# EAGLE design SparkFun_GPS_ZED-F9R_BoB (EAGLE 9.5.2)

## Sheet 1 of 3
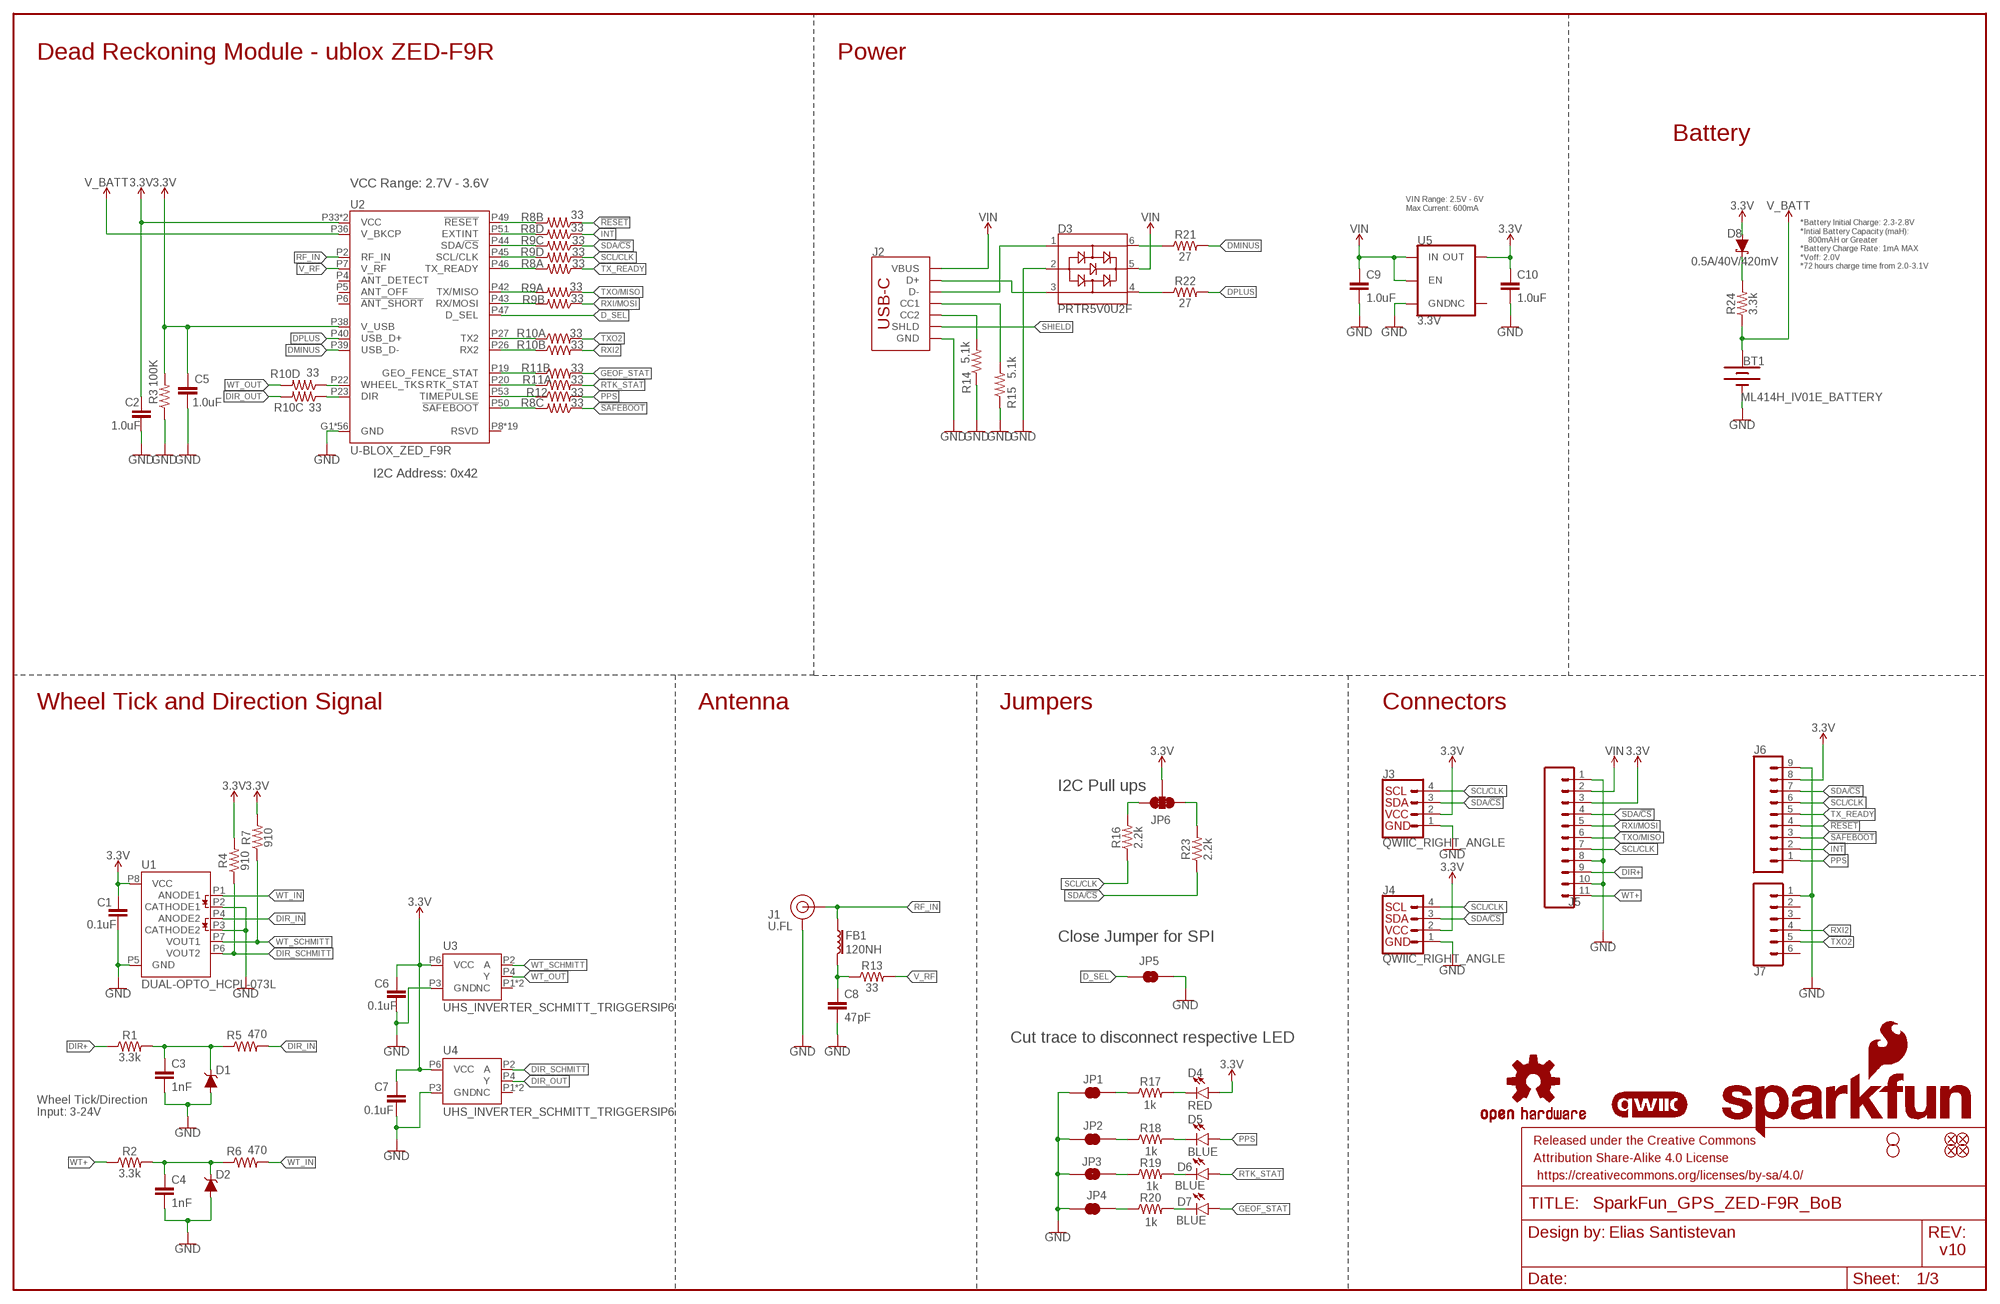
[diagram p0: schematic, sheet 1]

### Parts
$1_25_$_2020-03-30_22-52-05  STAND-OFFTIGHT  [STAND-OFF-TIGHT]
BT1  ML414H_IV01E_BATTERY  [ML414H_IV01E]
C1  0.1uF  0.1UF-0402-10V-10%-X7R  [0402]
C2  1.0uF  1.0UF-0603-16V-10%-X7R  [0603]
C3  1nF  1.0NF/1000PF-0402-25V-10%-X7R  [0402]
C4  1nF  1.0NF/1000PF-0402-25V-10%-X7R  [0402]
C5  1.0uF  1.0UF-0603-16V-10%-X7R  [0603]
C6  0.1uF  0.1UF-0402-10V-10%-X7R  [0402]
C7  0.1uF  0.1UF-0402-10V-10%-X7R  [0402]
C8  47pF  47PF-0402-25V-5%-X7R  [0402]
C9  1.0uF  1.0UF-0603-16V-10%-X7R  [0603]
C10  1.0uF  1.0UF-0603-16V-10%-X7R  [0603]
D1  15V  DIODE-ZENER-BZX84C15LT3G  [SOT23-3]
D2  15V  DIODE-ZENER-BZX84C15LT3G  [SOT23-3]
D3  PRTR5V0U2F  [SOT886]
D4  RED  LED-RED0603  [LED-0603]
D5  BLUE  LED-BLUE0603  [LED-0603]
D6  BLUE  LED-BLUE0603  [LED-0603]
D7  BLUE  LED-BLUE0603  [LED-0603]
D8  0.5A/40V/420mV  DIODE-SCHOTTKY-PMEG4005EJ  [SOD-323]
FB1  120NH  FERRITE_BEAD_GNSS  [0402_MURATA]
FD1  FIDUCIALUFIDUCIAL  [FIDUCIAL-MICRO]
FD2  FIDUCIALUFIDUCIAL  [FIDUCIAL-MICRO]
FD3  FIDUCIALUFIDUCIAL  [FIDUCIAL-MICRO]
FD4  FIDUCIALUFIDUCIAL  [FIDUCIAL-MICRO]
FRAME1  FRAME-LEDGER  [CREATIVE_COMMONS]
H2  STAND-OFFTIGHT  [STAND-OFF-TIGHT]
J1  U.FL  U.FL2PIN  [U.FL]
J2  USB_C_2-LAYER_PADS  [USB-C-16P-2LAYER-PADS]
J3  QWIIC_RIGHT_ANGLE  QWIIC_CONNECTORJS-1MM  [JST04_1MM_RA]
J4  QWIIC_RIGHT_ANGLE  QWIIC_CONNECTORJS-1MM  [JST04_1MM_RA]
J5  CONN_111X11_NO_SILK  [1X11_NO_SILK]
J6  CONN_09NO_SILK  [1X09_NO_SILK]
J7  CONN_06NO_SILK_NO_POP  [1X06_NO_SILK]
JP1  JUMPER-SMT_2_NC_TRACE_SILK  [SMT-JUMPER_2_NC_TRACE_SILK]
JP2  JUMPER-SMT_2_NC_TRACE_SILK  [SMT-JUMPER_2_NC_TRACE_SILK]
JP3  JUMPER-SMT_2_NC_TRACE_SILK  [SMT-JUMPER_2_NC_TRACE_SILK]
JP4  JUMPER-SMT_2_NC_TRACE_SILK  [SMT-JUMPER_2_NC_TRACE_SILK]
JP5  JUMPER-SMT_2_NO_SILK  [SMT-JUMPER_2_NO_SILK]
JP6  JUMPER-SMT_3_2-NC_TRACE_SILK  [SMT-JUMPER_3_2-NC_TRACE_SILK]
LOGO1  OSHW-LOGOM  [OSHW-LOGO-M]
LOGO2  QWIIC_LOGO_4MM  [QWIIC_4MM]
LOGO3  SFE_LOGO_NAME_FLAME.2_INCH  [SFE_LOGO_NAME_FLAME_.2]
R1  3.3k  3.3KOHM-0603-1/10W-1%  [0603]
R2  3.3k  3.3KOHM-0603-1/10W-1%  [0603]
R3  100K  100KOHM-0402-1/16W-1%  [0402]
R4  910  910OHM-0603-1/10W-5%  [0603]
R5  470  470OHM-0603-1/10W-1%  [0603]
R6  470  470OHM-0603-1/10W-1%  [0603]
R7  910  910OHM-0603-1/10W-5%  [0603]
R8  33  33OHM_RA-1206-1/16W-5%  [1206_RA]
R9  33  33OHM_RA-1206-1/16W-5%  [1206_RA]
R10  33  33OHM_RA-1206-1/16W-5%  [1206_RA]
R11  33  33OHM_RA-1206-1/16W-5%  [1206_RA]
R12  33  33OHM-0603-1/10W-1%  [0603]
R13  33  33OHM-0603-1/10W-1%  [0603]
R14  5.1k  5.1KOHM-0402-1/16W-1%  [0402]
R15  5.1k  5.1KOHM-0402-1/16W-1%  [0402]
R16  2.2k  2.2KOHM-0603-1/10W-1%  [0603]
R17  1KOHM-0402-1/16W-1%  [0402]
R18  1KOHM-0402-1/16W-1%  [0402]
R19  1KOHM-0402-1/16W-1%  [0402]
R20  1KOHM-0402-1/16W-1%  [0402]
R21  27  27OHM-0603-1/10W-1%  [0603]
R22  27  27OHM-0603-1/10W-1%  [0603]
R23  2.2k  2.2KOHM-0603-1/10W-1%  [0603]
R24  3.3k  3.3KOHM-0603-1/10W-1%  [0603]
U1  DUAL-OPTO_HCPL-073L  [SOP_8-PIN]
U2  U-BLOX_ZED_F9R  [UBLOX_ZED_F9R]
U3  UHS_INVERTER_SCHMITT_TRIGGERSIP6  [SIP6]
U4  UHS_INVERTER_SCHMITT_TRIGGERSIP6  [SIP6]
U5  3.3V  V_REG_AP2112K-3.3V  [SOT23-5]

### Nets
3.3V: C1.1 C2.1 C5.1 C6.1 C7.1 C10.1 D4.A D8.A J3.2 J4.2 J5.3 J6.8 JP6.2 R3.2 R4.2 R7.2 U1.P8(VCC) U2.P33(VCC) U2.P34(VCC) U2.P38(V_USB) U3.P6(VCC) U4.P6(VCC) U5.5(OUT)
!RESET: J6.4 R8.P2
!SAFEBOOT: J6.3 R8.P3
D_SEL: JP5.1 U2.P47(D_SEL)
DIR+: J5.9 R1.1
DIR_IN: R5.2 U1.P4(ANODE2)
DIR_OUT: R10.P6 U4.P4(Y)
DIR_SCHMITT: R4.1 U1.P6(VOUT2) U4.P2(A)
DMINUS: R21.2 U2.P39(USB_D-)
DPLUS: R22.2 U2.P40(USB_D+)
GEOF_STAT: D7.A R11.P7
GND: BT1.- C1.2 C2.2 C3.2 C4.2 C5.2 C6.2 C7.2 C8.2 C9.2 C10.2 D1.1(A) D2.1(A) D3.2 J1.1(GND) J1.2(GND) J2.GND J2.GND2(GND) J3.1 J4.1 J5.1 J5.8 J5.10 J6.9 J7.1 JP1.1 JP2.1 JP3.1 JP4.1 JP5.2 R3.1 R14.1 R15.1 U1.P2(CATHODE1) U1.P3(CATHODE2) U1.P5(GND) U2.G1(GND) U2.G2(GND) U2.G3(GND) U2.G4(GND) U2.G5(GND) U2.G6(GND) U2.G7(GND) U2.G8(GND) U2.G9(GND) U2.G10(GND) U2.G11(GND) U2.G12(GND) U2.G13(GND) U2.G14(GND) U2.G15(GND) U2.G16(GND) U2.G17(GND) U2.G18(GND) U2.G19(GND) U2.G20(GND) U2.G21(GND) U2.G22(GND) U2.G23(GND) U2.G24(GND) U2.G25(GND) U2.G26(GND) U2.G27(GND) U2.G28(GND) U2.G29(GND) U2.G30(GND) U2.G31(GND) U2.G32(GND) U2.G33(GND) U2.G34(GND) U2.G35(GND) U2.G36(GND) U2.G37(GND) U2.G38(GND) U2.G39(GND) U2.G40(GND) U2.G41(GND) U2.G42(GND) U2.G43(GND) U2.G44(GND) U2.G45(GND) U2.G46(GND) U2.G47(GND) U2.G48(GND) U2.P1(GND) U2.P3(GND) U2.P12(GND) U2.P14(GND) U2.P32(GND) U2.P37(GND) U2.P41(GND) U2.P48(GND) U3.P3(GND) U4.P3(GND) U5.2(GND)
INT: J6.2 R8.P4
N$1: JP6.1 R23.2
N$2: D8.C R24.2
N$3: JP6.3 R16.2
N$4: D4.C R17.2
N$5: C8.1 FB1.P2 R13.1
N$6: D3.3 J2.A6(D+) J2.B6(D+)
N$7: D3.1 J2.A7(D-) J2.B7(D-)
N$8: JP1.2 R17.1
N$9: D3.6 R21.1
N$10: D3.4 R22.1
N$11: R8.P7 U2.P49(!RESET!)
N$12: R8.P5 U2.P51(EXTINT)
N$14: J2.B5(CC2) R14.2
N$15: J2.A5(CC1) R15.2
N$16: R9.P6 U2.P44(SDA/!CS!)
N$17: R9.P5 U2.P45(SCL/CLK)
N$18: R8.P8 U2.P46(TX_READY)
N$19: R9.P8 U2.P42(TX/MISO)
N$20: R9.P7 U2.P43(RX/MOSI)
N$21: R10.P1 U2.P27(TX2)
N$22: JP3.2 R19.1
N$23: JP2.2 R18.1
N$24: D5.C R18.2
N$25: D6.C R19.2
N$26: R10.P2 U2.P26(RX2)
N$27: R11.P2 U2.P19(GEO_FENCE_STAT)
N$28: R11.P1 U2.P20(RTK_STAT)
N$29: R12.1 U2.P53(TIMEPULSE)
N$30: R8.P6 U2.P50(!SAFEBOOT!)
N$31: R10.P4 U2.P22(WHEEL_TKS)
N$32: R10.P3 U2.P23(DIR)
N$33: JP4.2 R20.1
N$34: D7.C R20.2
N$35: C4.1 D2.3(C) R2.2 R6.1
N$37: C3.1 D1.3(C) R1.2 R5.1
PPS: D5.A J6.1 R12.2
RF_IN [Antenna]: FB1.P1 J1.FEED(SIGNAL) U2.P2(RF_IN)
RTK_STAT: D6.A R11.P8
RXI2: J7.4 R10.P7
RXI/MOSI: J5.5 R9.P2
SCL/CLK: J3.4 J4.4 J5.7 J6.6 R9.P4 R16.1
SDA/!CS: J3.3 J4.3 J5.4 J6.7 R9.P3 R23.1
SHIELD: J2.SHLD1(SHLD) J2.SHLD2(SHLD) J2.SHLD3(SHLD) J2.SHLD4(SHLD)
TX_READY: J6.5 R8.P1
TXO2: J7.5 R10.P8
TXO/MISO: J5.6 R9.P1
V_BATT: BT1.+ R24.1 U2.P36(V_BKCP)
V_RF: R13.2 U2.P7(V_RF)
VIN: C9.1 D3.5 J2.VBUS1(VBUS) J2.VBUS2(VBUS) J5.2 U5.1(IN) U5.3(EN)
WT+: J5.11 R2.1
WT_IN: R6.2 U1.P1(ANODE1)
WT_OUT: R10.P5 U3.P4(Y)
WT_SCHMITT: R7.1 U1.P7(VOUT1) U3.P2(A)
Unconnected: J7.2 J7.3 J7.6 R11.P3 R11.P4 R11.P5 R11.P6 U2.P4(ANT_DETECT) U2.P5(ANT_OFF) U2.P6(!ANT_SHORT!) U2.P8(RSVD) U2.P9(RSVD) U2.P10(RSVD) U2.P11(RSVD) U2.P13(RSVD) U2.P15(RSVD) U2.P16(RSVD) U2.P17(RSVD) U2.P18(RSVD) U2.P21(RSVD) U2.P24(RSVD) U2.P25(RSVD) U2.P28(RSVD) U2.P29(RSVD) U2.P30(RSVD) U2.P31(RSVD) U2.P35(RSVD) U2.P52(RSVD) U2.P54(RSVD) U3.P1(NC) U3.P5(NC) U4.P1(NC) U4.P5(NC) U5.4(NC)

### Notes on the sheet
- Dead Reckoning Module - ublox ZED-F9R | Power
- Battery
- VCC Range: 2.7V - 3.6V
- VIN Range: 2.5V - 6V
  Max Current: 600mA
- *Battery Initial Charge: 2.3-2.8V
  *Intial Battery Capacity (maH): 
      800mAH or Greater
  *Battery Charge Rate: 1mA MAX
  *Voff: 2.0V
  *72 hours charge time from 2.0-3.1V
- I2C Address: 0x42
- Wheel Tick and Direction Signal | Antenna | Jumpers | Connectors
- I2C Pull ups
- Close Jumper for SPI
- Cut trace to disconnect respective LED
- 1k
- Wheel Tick/Direction
  Input: 3-24V
- 1k
- 1k
- 1k
- Elias Santistevan
- v10

## Sheet 2 of 3

## Sheet 3 of 3

## Library data of the parts
$1_25_$_2020-03-30_22-52-05 H2 = SparkFun-Hardware:STAND-OFF: Stand Off Drill holes for mechanically mounting via screws, standoffs, etc. Note: Use the keepout ring to avoid running the screw head into surrounding components. Variant Overviews STAND-OFF - Mechanical footprint for a #4 phillips button head screw. STAND-OFF-TIGHT - Mechanical footprint for a #4 phillips button head screw, Example SparkFun Products Screw - Phillips Head (1/4", 4-40, 10 pack) <https://www.sparkfun.com/products/10453> (PRT-10453) Screw - Phillips Head (1/2", 4-40, 10 pack) <https://www.sparkfun.com/products/10452> (PRT-10452) Screw - Phillips Head (3/4", 4-40, 10 pack) <https://www.sparkfun.com/products/10451> (PRT-10451) Screw - Phillips Head (1", 4-40, 10 pack) <https://www.sparkfun.com/products/10450> (PRT-10450)
BT1 = SparkFun-Batteries:ML414H_IV01E_BATTERY: SEIKO ML414H-IV01E Reflowable Lithium Battery ML414H is a rechargeable, coin type battery with features such as Pb-free reflowable (Peak temperature: 260 C) and high temperature heat resistance. Battery Characteristics: 3.1V max voltage Voff is 2V 1mAH 3k series resistor with battery 72 hour charge time from 2.0-3.1V 2.3-2.8V initial charge; PROD_ID: BATT-14267
C1 C6 C7 = SparkFun-Capacitors:0.1UF: 0.1µF ceramic capacitors A capacitor is a passive two-terminal electrical component used to store electrical energy temporarily in an electric field.; PROD_ID: CAP-15083
C2 C5 C9 C10 = SparkFun-Capacitors:1.0UF: 1µF ceramic capacitors A capacitor is a passive two-terminal electrical component used to store electrical energy temporarily in an electric field.; PROD_ID: CAP-13930
C3 C4 = SparkFun-Capacitors:1.0NF/1000PF: 1nF/1,000pF ceramic capacitors A capacitor is a passive two-terminal electrical component used to store electrical energy temporarily in an electric field.; PROD_ID: CAP-15061
C8 = SparkFun-Capacitors:47PF: 47pF ceramic capacitors A capacitor is a passive two-terminal electrical component used to store electrical energy temporarily in an electric field.; PROD_ID: CAP-15063
D1 D2 = SparkFun-DiscreteSemi:DIODE-ZENER: Zener Diode A Zener diode allows current to flow from its anode to its cathode like a normal semiconductor diode, but it also permits current to flow in the reverse direction when its "Zener voltage" is reached. - WIkipedia; PROD_ID: DIO-15071
D3 = SparkFun-IC-Power:PRTR5V0U2: A small ESD protection device. Most commonly used on USB D+/D- signals to protect large, expensive, or especially sensitive USB enabled devices.; PROD_ID: DIO-14084
D4 = SparkFun-LED:LED-RED: Red SMD LED Used in manufacturing of most products at SparkFun Packages: 0603 - SMD 0603 package [Product Link] <http://docs.avagotech.com/docs/AV02-0551EN> 0603 SMART - SMD 0603 SMART package ( more efficient and expensive)[Product Link] <http://www.osram-os.com/Graphics/XPic2/00077099_0.pdf> 1206 - SMD1206 package [Product Link] <https://www.sparkfun.com/datasheets/DevTools/LilyPad/Q150OVS4.pdff> SparkFun Products: Pro Mini 328 -5V <https://www.sparkfun.com/products/821> RedBoard <https://www.sparkfun.com/products/12757> IOIO-OTG <https://www.sparkfun.com/products/13613>; PROD_ID: DIO-00819
D5-D7 = SparkFun-LED:LED-BLUE: Blue SMD LED Used in manufacturing of various products at SparkFun Packages: 0603 - SMD 0603 package [Product Link] <http://www.digikey.com/product-detail/en/SMLE12BC7TT86/511-1589-2-ND/1641808> 1206 - SMD1206 package [Product Link] <http://www.digikey.com/product-detail/en/lite-on-inc/LTST-C150TBKT/160-1643-1-ND/573584> SparkFun Products: ESP8266 Thing-Dev Board <https://www.sparkfun.com/products/13711> RedBoard <https://www.sparkfun.com/products/12757>; PROD_ID: DIO-08575
D8 = SparkFun-DiscreteSemi:DIODE-SCHOTTKY: Schottky diode A Schottky diode is a semiconductor diode which has a low forward voltage drop and a very fast switching action.; PROD_ID: DIO-10955
FB1 = SparkFun-Coils:FERRITE_BEAD_GNSS; PROD_ID: NDUC-15072
FD1-FD4 = SparkFun-Aesthetics:FIDUCIAL: Fiducial Alignment Points Point-of-reference for pick-and-place machines and other optical instruments.
FRAME1 = SparkFun-Aesthetics:FRAME-LEDGER: Schematic Frame - Ledger Standard 11x14 US Ledger frame
J1 = SparkFun-Connectors:U.FL2PIN: SMD Antenna Connector - U.FL 2mm height, 3.0mm x 3.0mm receptacle size. SparkFun Products: SparkFun WiFi Shield - ESP8266 <https://www.sparkfun.com/products/13287> SparkFun ESP8266 Thing <https://www.sparkfun.com/products/13231> SparkFun MiniGen - Pro Mini Signal Generator Shield <https://www.sparkfun.com/products/11420>; PROD_ID: CONN-09193; SF_ID: WRL-09144
J2 = SparkFun-Connectors:USB_C: USB Type C 16Pin Connector Super Speed pins not available on the 16-pin purely SMD connector so this part is best for USB 2.0 implementations. D1 and D2 are tied together enabling D+/- no matter which way the cable is plugged into the connector. The two channel configuration pins (CC1/2) are exposed. These are normally connected to ground via 5.1k resistors but can be reconfigured for high current/high power applications.; PROD_ID: CONN-14122
J3 J4 = SparkFun-Connectors:QWIIC_CONNECTOR: SparkFun I2C Standard Qwiic Connector An SMD 1mm pitch JST connector makes it easy and quick (get it? Qwiic?) to connect I2C devices to each other. The Qwiic system <http://www.sparkfun.com/qwiic> enables fast and solderless connection between popular platforms and various sensors and actuators. We carry 200mm <https://www.sparkfun.com/products/14204>, 100mm <https://www.sparkfun.com/products/14205>, 50mm <https://www.sparkfun.com/products/14206>, and breadboard friendly <https://www.sparkfun.com/products/14207> Qwiic cables. We also offer 10 pcs strips <https://www.sparkfun.com/products/14323> the SMD connectors.; PROD_ID: CONN-13694
J5 = SparkFun-Connectors:CONN_11: Multi connection point. Often used as Generic Header-pin footprint for 0.1 inch spaced/style header connections On any of the 0.1 inch spaced packages, you can populate with these: Break Away Headers - Straight <https://www.sparkfun.com/products/116> (PRT-00116) Break Away Male Headers - Right Angle <https://www.sparkfun.com/products/553> (PRT-00553) Female Headers <https://www.sparkfun.com/products/115> (PRT-00115) Break Away Headers - Machine Pin <https://www.sparkfun.com/products/117> (PRT-00117) Break Away Female Headers - Swiss Machine Pin <https://www.sparkfun.com/products/743> (PRT-00743) For SCREWTERMINALS and SPRING TERMINALS visit here: Screw Terimnals on SparkFun.com <https://www.sparkfun.com/search/results?term=Screw+Terminals> (5mm/3.5mm/2.54mm spacing) This device is also useful as a general connection point to wire up your design to another part of your project. Our various solder wires solder well into these plated through hole pads. Hook-Up Wire - Assortment (Stranded, 22 AWG) <https://www.sparkfun.com/products/11375> (PRT-11375) Hook-Up Wire - Assortment (Solid Core, 22 AWG) <https://www.sparkfun.com/products/11367> (PRT-11367) View the entire wire category on our website here <https://www.sparkfun.com/categories/141>
J6 = SparkFun-Connectors:CONN_09: Multi connection point. Often used as Generic Header-pin footprint for 0.1 inch spaced/style header connections On any of the 0.1 inch spaced packages, you can populate with these: Break Away Headers - Straight <https://www.sparkfun.com/products/116> (PRT-00116) Break Away Male Headers - Right Angle <https://www.sparkfun.com/products/553> (PRT-00553) Female Headers <https://www.sparkfun.com/products/115> (PRT-00115) Break Away Headers - Machine Pin <https://www.sparkfun.com/products/117> (PRT-00117) Break Away Female Headers - Swiss Machine Pin <https://www.sparkfun.com/products/743> (PRT-00743) For SCREWTERMINALS and SPRING TERMINALS visit here: Screw Terimnals on SparkFun.com <https://www.sparkfun.com/search/results?term=Screw+Terminals> (5mm/3.5mm/2.54mm spacing) This device is also useful as a general connection point to wire up your design to another part of your project. Our various solder wires solder well into these plated through hole pads. Hook-Up Wire - Assortment (Stranded, 22 AWG) <https://www.sparkfun.com/products/11375> (PRT-11375) Hook-Up Wire - Assortment (Solid Core, 22 AWG) <https://www.sparkfun.com/products/11367> (PRT-11367) View the entire wire category on our website here <https://www.sparkfun.com/categories/141> Special notes: Molex polarized connector foot print use with SKU : PRT-08231 with associated crimp pins and housings. 1MM SMD Version SKU: PRT-10208 NOTES ON THE VARIANTS LOCK and LOCK_LONGPADS... This footprint was designed to help hold the alignment of a through-hole component (i.e. 6-pin header) while soldering it into place. You may notice that each hole has been shifted either up or down by 0.005 of an inch from it's more standard position (which is a perfectly straight line). This slight alteration caused the pins (the squares in the middle) to touch the edges of the holes. Because they are alternating, it causes a "brace" to hold the component in place. 0.005 has proven to be the perfect amount of "off-center" position when using our standard breakaway headers. Although looks a little odd when you look at the bare footprint, once you have a header in there, the alteration is very hard to notice. Also,if you push a header all the way into place, it is covered up entirely on the bottom side.
J7 = SparkFun-Connectors:CONN_06: Multi connection point. Often used as Generic Header-pin footprint for 0.1 inch spaced/style header connections On any of the 0.1 inch spaced packages, you can populate with these: Break Away Headers - Straight <https://www.sparkfun.com/products/116> (PRT-00116) Break Away Male Headers - Right Angle <https://www.sparkfun.com/products/553> (PRT-00553) Female Headers <https://www.sparkfun.com/products/115> (PRT-00115) Break Away Headers - Machine Pin <https://www.sparkfun.com/products/117> (PRT-00117) Break Away Female Headers - Swiss Machine Pin <https://www.sparkfun.com/products/743> (PRT-00743) Arduino Stackable Header - 6 Pin <https://www.sparkfun.com/products/9280> (PRT-09280) For SCREWTERMINALS and SPRING TERMINALS visit here: Screw Terimnals on SparkFun.com <https://www.sparkfun.com/search/results?term=Screw+Terminals> (5mm/3.5mm/2.54mm spacing) This device is also useful as a general connection point to wire up your design to another part of your project. Our various solder wires solder well into these plated through hole pads. Hook-Up Wire - Assortment (Stranded, 22 AWG) <https://www.sparkfun.com/products/11375> (PRT-11375) Hook-Up Wire - Assortment (Solid Core, 22 AWG) <https://www.sparkfun.com/products/11367> (PRT-11367) View the entire wire category on our website here <https://www.sparkfun.com/categories/141>
JP1-JP4 = SparkFun-Jumpers:JUMPER-SMT_2_NC_TRACE: Normally closed trace jumper This jumper has a trace between two pads so it's normally closed (NC). Use a razor knife to open the connection. For best results follow the IPC guidelines for cutting traces: Cutout at least 0.063 mm (0.005 in). Remove all loose material to clean up the cut area. Seal the cut with an approved epoxy. Reapply solder to reclose the connection.
JP5 = SparkFun-Jumpers:JUMPER-SMT_2_NO: Normally open jumper This jumper has two pads in close proximity to each other. Apply solder to close the connection. Round pads are easier to solder for beginners, but are a lot larger. SparkFun Product that uses the round pads: SparkFun EL Sequencer <https://www.sparkfun.com/products/12781>
JP6 = SparkFun-Jumpers:JUMPER-SMT_3_2-NC_TRACE: Normally closed trace jumper (2 of 2 connections) This jumper has a trace between all three pads so they are normally closed (NC). Use a razor knife to open the connection(s). For best results follow the IPC guidelines for cutting traces: Cutout at least 0.063 mm (0.005 in). Remove all loose material to clean up the cut area. Seal the cut with an approved epoxy. Reapply solder to reclose the connection(s).
LOGO1 = SparkFun-Aesthetics:OSHW-LOGO: Open-Source Hardware (OSHW) Logo This logo indicates the piece of hardware it is found on incorporates a OSHW license and/or adheres to the definition of open source hardware found here: http://freedomdefined.org/OSHW
LOGO2 = SparkFun-Aesthetics:QWIIC_LOGO: Qwiic Logos for placement on schematic and PCB. The 5.5mm silk logo is best for placing next to Qwiic connector.
LOGO3 = SparkFun-Aesthetics:SFE_LOGO_NAME_FLAME: SparkFun Font Logo w/ Flame This is the SparkFun full logo. The logo on the schematic will always be the same size; the package variant is the height of the flame part of the logo. Default layer for the logo on the board is tSilk.
R1 R2 R24 = SparkFun-Resistors:3.3KOHM: 3.3kΩ resistor A resistor is a passive two-terminal electrical component that implements electrical resistance as a circuit element. Resistors act to reduce current flow, and, at the same time, act to lower voltage levels within circuits. - Wikipedia; PROD_ID: RES-07851
R3 = SparkFun-Resistors:100KOHM: 100kΩ resistor A resistor is a passive two-terminal electrical component that implements electrical resistance as a circuit element. Resistors act to reduce current flow, and, at the same time, act to lower voltage levels within circuits. - Wikipedia; PROD_ID: RES-13495
R4 R7 = SparkFun-Resistors:910OHM: 910 Ohm Resistor A resistor is a passive two-terminal electrical component that implements electrical resistance as a circuit element. Resistors act to reduce current flow, and, at the same time, act to lower voltage levels within circuits. - Wikipedia Digikey Link <https://www.digikey.com/product-detail/en/yageo/RC0603JR-07910RL/311-910GRTR-ND/726838>; PROD_ID: RES-13860
R5 R6 = SparkFun-Resistors:470OHM: 470Ω resistor A resistor is a passive two-terminal electrical component that implements electrical resistance as a circuit element. Resistors act to reduce current flow, and, at the same time, act to lower voltage levels within circuits. - Wikipedia; PROD_ID: RES-07869
R8-R11 = SparkFun-Resistors:33OHM_RA: EXB-38V330JV Four Resistory Array - AEC-Q200 Certified; PROD_ID: RES-15081
R12 R13 = SparkFun-Resistors:33OHM: 33Ω resistor A resistor is a passive two-terminal electrical component that implements electrical resistance as a circuit element. Resistors act to reduce current flow, and, at the same time, act to lower voltage levels within circuits. - Wikipedia; PROD_ID: RES-08270
R14 R15 = SparkFun-Resistors:5.1KOHM; PROD_ID: RES-14340
R16 R23 = SparkFun-Resistors:2.2KOHM: 2.2kΩ resistor A resistor is a passive two-terminal electrical component that implements electrical resistance as a circuit element. Resistors act to reduce current flow, and, at the same time, act to lower voltage levels within circuits. - Wikipedia; PROD_ID: RES-08272
R17-R20 = SparkFun-Resistors:1KOHM: 1kΩ resistor A resistor is a passive two-terminal electrical component that implements electrical resistance as a circuit element. Resistors act to reduce current flow, and, at the same time, act to lower voltage levels within circuits. - Wikipedia; PROD_ID: RES-14342
R21 R22 = SparkFun-Resistors:27OHM: 27Ω resistor A resistor is a passive two-terminal electrical component that implements electrical resistance as a circuit element. Resistors act to reduce current flow, and, at the same time, act to lower voltage levels within circuits. - Wikipedia; PROD_ID: RES-09334
U1 = SparkFun-DiscreteSemi:DUAL-OPTO_HCPL-073L: HCPL-073L These high gain series couplers use a Light Emitting Diode and an integrated high gain photodetector to provide extremely high current transfer ratio between input and output. Separate pins for the photodiode and output stage result in LVTTL compatible saturation voltages and high speed operation. Where desired, the VCC and VO terminals may be tied together to achieve conventional photo-darlington operation. A base access terminal allows a gain bandwidth adjustment to be made. These optocouplers are for use in LVTTL/LVCMOS or other low power applications. A 400% minimum current transfer ratio is guaranteed over 0 to +70˚C operating range for only 0.5 mA of LED current. Digikey Link <https://www.digikey.com/product-detail/en/broadcom-limited/HCPL-073L-500E/516-4204-2-ND/1234512>; PROD_ID: IC-15070
U2 = SparkFun-GPS:U-BLOX_ZED_F9R: u-blox ZED-F9K ADR GPS Unit with Real Time Kinematics (RTK) and internal IMU = Automotive Dead Reckoning; PROD_ID: IC-14716
U3 U4 = SparkFun-IC-Amplifiers:UHS_INVERTER_SCHMITT_TRIGGER: NC7SZ14 The NC7SZ14 is a single inverter with Schmitt trigger input from ON Semiconductor’s Ultra−High Speed (UHS) series of TinyLogic. The device is fabricated w ith advanced CMOS technology to achieve ultra−high speed with high output drive while maintaining low static power dissipation over a very broad VCC operating range. The device is specified to operate over the 1.65 V to 5.5 V VCC range. The inputs and outputs are high−impedance when VCC is 0 V. Inputs tolerate voltages up to 5.5 V independent of VCC operating voltage. Digikey Link <https://www.digikey.com/product-detail/en/on-semiconductor/NC7SZ14M5X/NC7SZ14M5XDKR-ND/1628606>; PROD_ID: IC-15068
U5 = SparkFun-IC-Power:V_REG_AP2112: AP2112 - 600mA CMOS LDO Regulator w/ Enable The AP2112 is CMOS process low dropout linear regulator with enable function, the regulator delivers a guaranteed 600mA (min.) continuous load current. Features Output Voltage Accuracy: ±1.5% Output Current: 600mA (Min.) Foldback Short Current Protection: 50mA Enable Function to Turn ON/OFF VOUT Low Dropout Voltage (3.3V): 250mV (Typ.) @IOUT=600mA Excellent Load Regulation: 0.2%/A (Typ.) Excellent Line Regulation: 0.02%/V (Typ.) Low Quiescent Current: 55μA (Typ.) Low Standby Current: 0.01μA (Typ.) Low Output Noise: 50μVRMS PSRR: 100Hz -65dB, 1kHz -65dB OTSD Protection Stable with 1.0μF Flexible Cap: Ceramic, Tantalum and Aluminum Electrolytic Operation Temperature Range: -40°C to 85°C ESD: MM 400V, HBM 4000V; PROD_ID: VREG-12457

## Net classes
1 Antenna: width 1 mm, clearance 0.3 mm

## Board
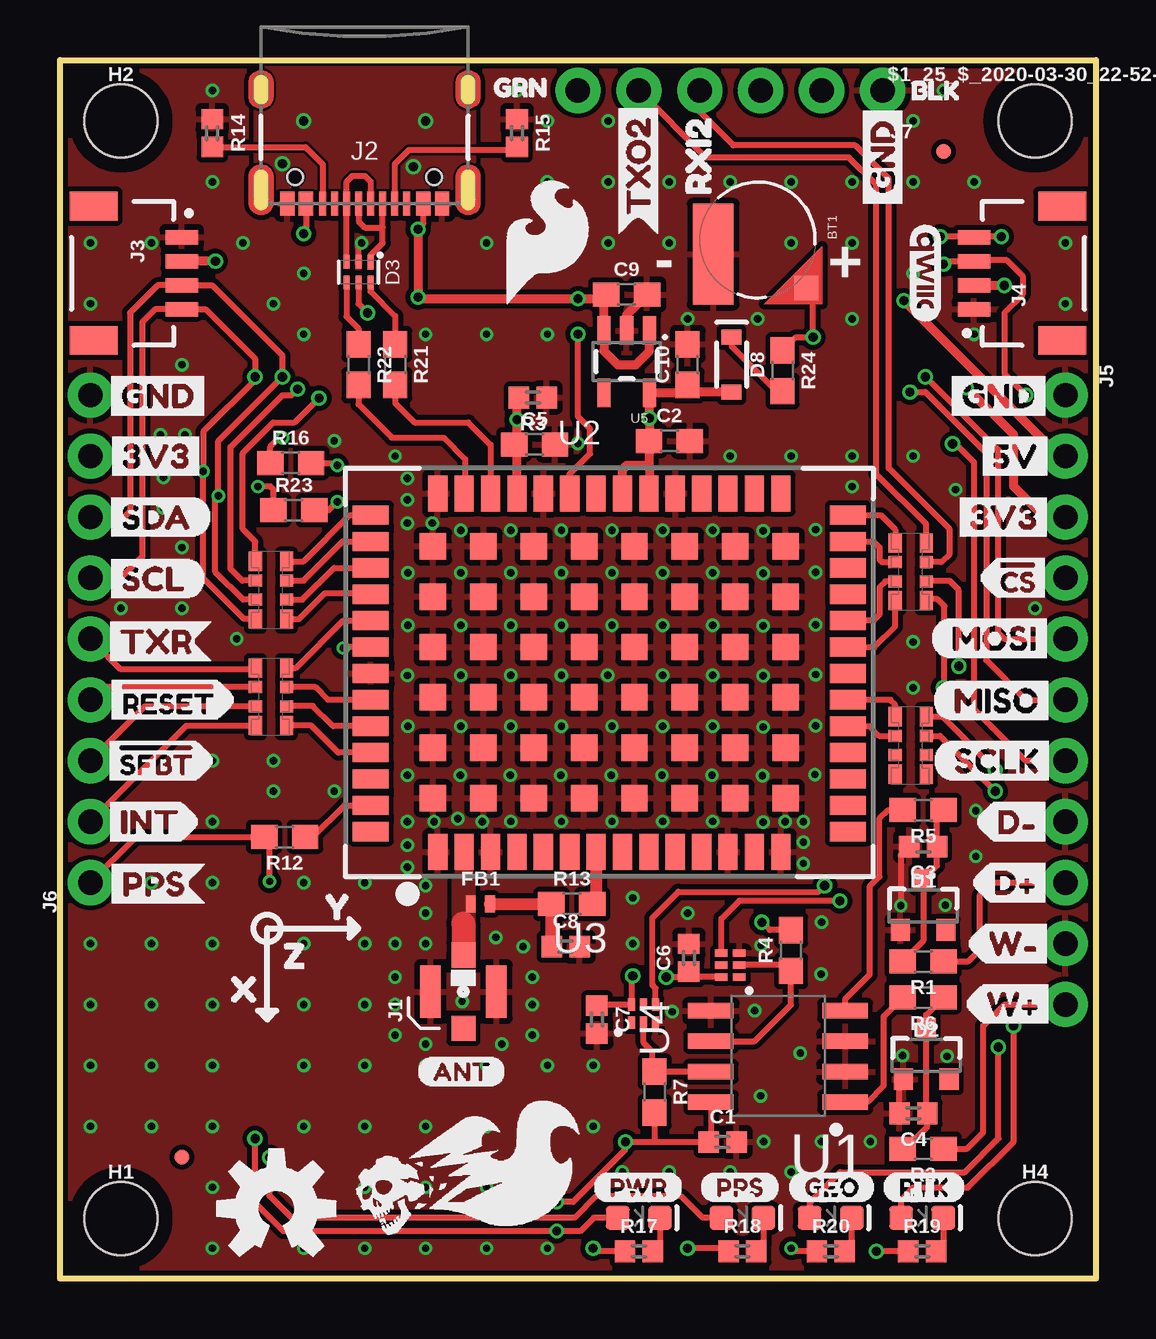
[diagram p1: board, top side]
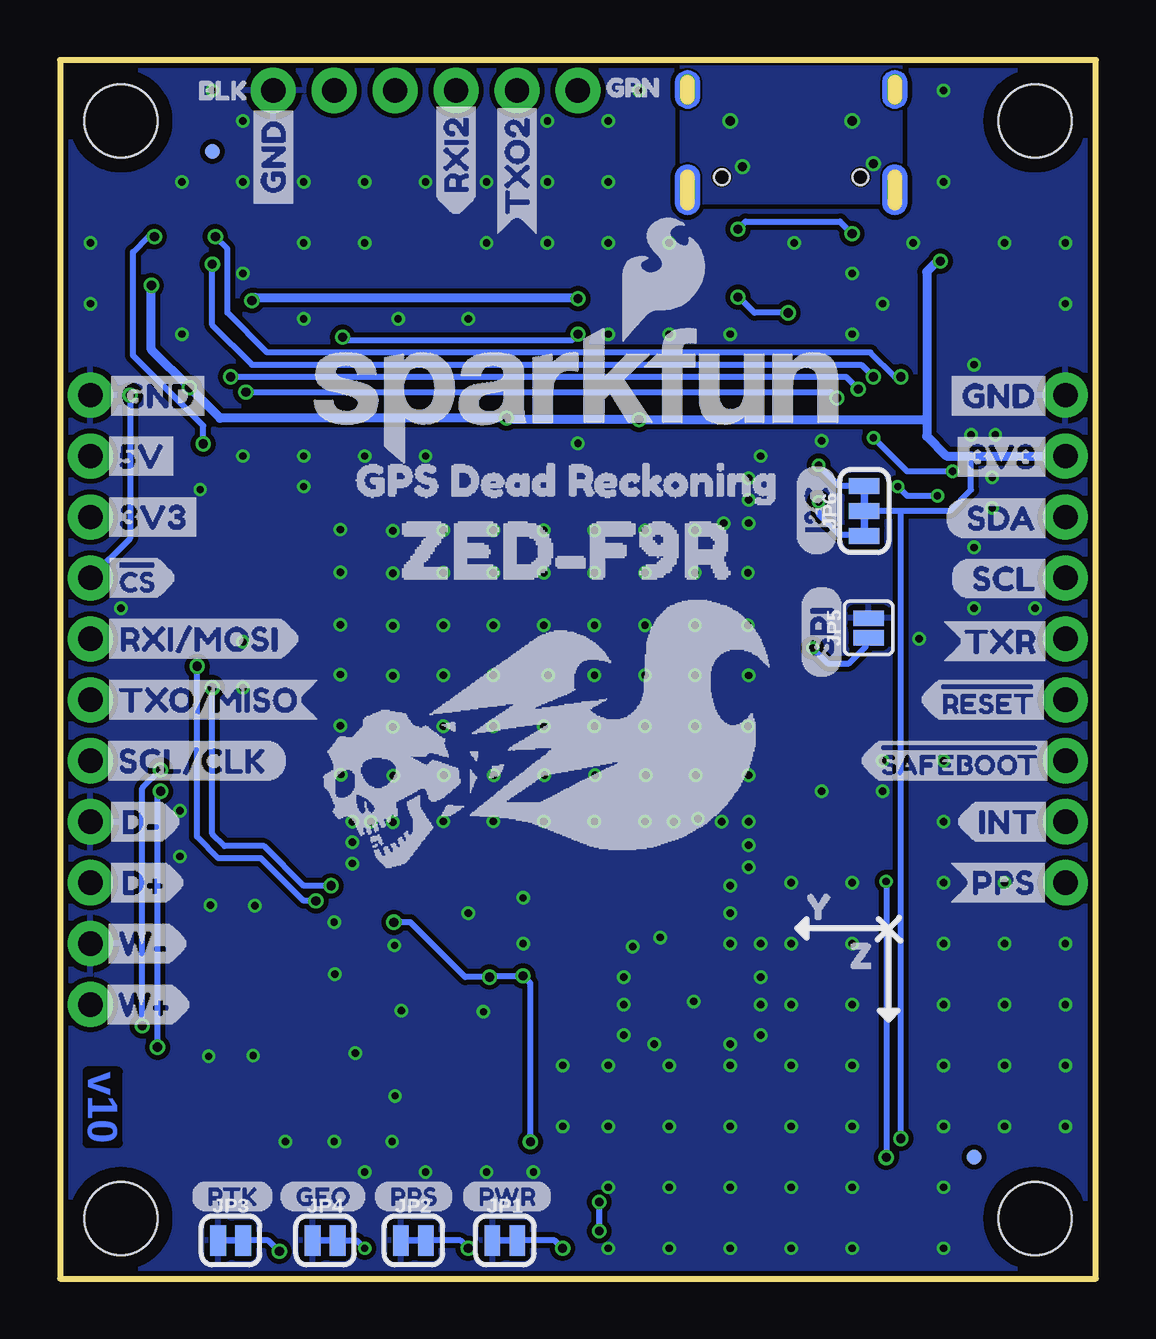
[diagram p2: board, bottom side, seen from below]

Size 43.18 x 50.8 mm. Coordinates in mm from the lower left corner, seen from the top.
Outline: 0,0 0,50.8 43.18,50.8 43.18,0 0,0
Copper layers (1*16): Top 0.035mm / dielectric 1.5mm / Bottom 0.035mm
Design rules "SparkFun-2-layer-FAB-LIMIT": minimum track width 4mil, minimum drill 6mil, track to track 4mil, track to pad 4mil, pad to pad 4mil, via to via 4mil, smd to smd 4mil, copper to edge 4mil, drill to drill 4mil, minimum pad ring 5mil, minimum via ring 5mil, stop-mask expansion 4mil, vias tented up to drill 25mil, thermal gap 10mil

### Footprints (pad centres in the part's own frame; a part is rotated, then mirrored left to right if it is on the bottom)
STAND-OFF-TIGHT = hole 3.048: 0,0
ML414H_IV01E = smd 1 x 1: + 2.022,2.032 | smd 4.2 x 1.7: - 0.6,-1.85
0402 = smd 0.85 x 0.9: 1 -0.58,0; 2 0.58,0
0603 = smd 1.1 x 1: 1 -0.85,0; 2 0.85,0
SOT23-3 = smd 0.8 x 0.9: 1 -0.95,-1; 2 0.95,-1; 3 0,1.1
SOT886 = smd 0.61 x 0.25: 1 -0.405,0.5 | smd 0.56 x 0.25: 2 -0.43,0; 3 -0.43,-0.5; 4 0.43,-0.5; 5 0.43,0; 6 0.43,0.5
LED-0603 = smd 1 x 1: A -0.877,0; C 0.877,0
SOD-323 = smd 0.63 x 0.83: A 1.15,0; C -1.15,0
0402_MURATA = smd 0.4 x 0.7: P1 -0.4,0; P2 0.4,0
FIDUCIAL-MICRO = smd 0.635 x 0.635: 1 0,0
U.FL = smd 2.2 x 0.85: 1 0,1.375; 2 0,-1.375 | smd 1.05 x 1: FEED 1.525,0; NC -1.525,0
USB-C-16P-2LAYER-PADS = smd 0.3 x 1: A5 -1.25,-0.34; A6 -0.25,-0.34; A7 0.25,-0.34; A8 1.25,-0.34; B5 1.75,-0.34; B6 0.75,-0.34; B7 -0.75,-0.34; B8 -1.75,-0.34 | smd 0.6 x 1: GND -3.225,-0.34; GND2 3.225,-0.34; VBUS1 -2.45,-0.34; VBUS2 2.45,-0.34 | drill 0.4 pad 0.6 long: SHLD1 -4.318,-0.915; SHLD2 4.318,-0.915; SHLD3 -4.318,-5.095; SHLD4 4.318,-5.095 | hole 0.65: -2.89,-1.445; 2.89,-1.445
JST04_1MM_RA = smd 0.6 x 1.35: 1 -1.5,0; 2 -0.5,0; 3 0.5,0; 4 1.5,0 | smd 1.2 x 2: NC1 2.8,-3.675; NC2 -2.8,-3.675
1X11_NO_SILK = drill 1.016 pad 1.88: 1 0,0; 2 2.54,0; 3 5.08,0; 4 7.62,0; 5 10.16,0; 6 12.7,0; 7 15.24,0; 8 17.78,0; 9 20.32,0; 10 22.86,0; 11 25.4,0
1X09_NO_SILK = drill 1.016 pad 1.88: 1 0,0; 2 2.54,0; 3 5.08,0; 4 7.62,0; 5 10.16,0; 6 12.7,0; 7 15.24,0; 8 17.78,0; 9 20.32,0
1X06_NO_SILK = drill 1.016 pad 1.88: 1 0,0; 2 2.54,0; 3 5.08,0; 4 7.62,0; 5 10.16,0; 6 12.7,0
SMT-JUMPER_2_NC_TRACE_SILK = smd 0.66 x 1.27: 1 -0.521,0; 2 0.521,0
SMT-JUMPER_2_NO_SILK = smd 0.635 x 1.27: 1 -0.406,0; 2 0.406,0
SMT-JUMPER_3_2-NC_TRACE_SILK = smd 0.66 x 1.27: 1 -1.041,0; 2 0,0; 3 1.041,0
1206_RA = smd 0.8 x 0.55: P1 -1.2,-0.62; P4 1.2,-0.62; P5 1.2,0.68; P8 -1.2,0.68 | smd 0.5 x 0.55: P2 -0.4,-0.62; P3 0.4,-0.62; P6 0.4,0.68; P7 -0.4,0.68
SOP_8-PIN = smd 1.9 x 0.64: P1 -2.921,2.032; P2 -2.921,0.762; P3 -2.921,-0.508; P4 -2.921,-1.778; P5 2.679,-1.778; P6 2.679,-0.508; P7 2.679,0.762; P8 2.679,2.032
UBLOX_ZED_F9R = smd 1.1 x 1.1: G1 -7.312,-5.37; G2 -5.212,-5.37; G3 -3.112,-5.37; G4 -1.012,-5.37; G5 1.088,-5.37; G6 3.188,-5.37; G7 5.288,-5.37; G8 7.388,-5.37; G9 7.388,-3.27; G10 5.288,-3.27; G11 3.188,-3.27; G12 1.088,-3.27; G13 -1.012,-3.27; G14 -3.112,-3.27; G15 -5.212,-3.27; G16 -7.312,-3.27; G17 -7.312,-1.17; G18 -5.212,-1.17; G19 -3.112,-1.17; G20 -1.012,-1.17; G21 1.088,-1.17; G22 3.188,-1.17; G23 5.288,-1.17; G24 7.388,-1.17; G25 7.388,0.93; G26 5.288,0.93; G27 3.188,0.93; G28 1.088,0.93; G29 -1.012,0.93; G30 -3.112,0.93; G31 -5.212,0.93; G32 -7.312,0.93; G33 -7.312,3.03; G34 -5.212,3.03; G35 -3.112,3.03; G36 -1.012,3.03; G37 1.088,3.03; G38 3.188,3.03; G39 5.288,3.03; G40 7.388,3.03; G41 7.388,5.13; G42 5.288,5.13; G43 3.188,5.13; G44 1.088,5.13; G45 -1.012,5.13; G46 -3.112,5.13; G47 -5.212,5.13; G48 -7.312,5.13 | smd 0.8 x 1.5: P1 -7.112,-7.62; P2 -6.012,-7.62; P3 -4.912,-7.62; P4 -3.812,-7.62; P5 -2.712,-7.62; P6 -1.612,-7.62; P7 -0.512,-7.62; P8 0.588,-7.62; P9 1.688,-7.62; P10 2.788,-7.62; P11 3.888,-7.62; P12 4.988,-7.62; P13 6.088,-7.62; P14 7.188,-7.62; P28 7.188,7.33; P29 6.088,7.33; P30 4.988,7.33; P31 3.888,7.33; P32 2.788,7.33; P33 1.688,7.33; P34 0.588,7.33; P35 -0.512,7.33; P36 -1.612,7.33; P37 -2.712,7.33; P38 -3.812,7.33; P39 -4.912,7.33; P40 -6.012,7.33; P41 -7.112,7.33 | smd 1.5 x 0.8: P15 9.988,-6.77; P16 9.988,-5.67; P17 9.988,-4.57; P18 9.988,-3.47; P19 9.988,-2.37; P20 9.988,-1.27; P21 9.988,-0.17; P22 9.988,0.93; P23 9.988,2.03; P24 9.988,3.13; P25 9.988,4.23; P26 9.988,5.33; P27 9.988,6.43; P42 -9.912,6.43; P43 -9.912,5.33; P44 -9.912,4.23; P45 -9.912,3.13; P46 -9.912,2.03; P47 -9.912,0.93; P48 -9.912,-0.17; P49 -9.912,-1.27; P50 -9.912,-2.37; P51 -9.912,-3.47; P52 -9.912,-4.57; P53 -9.912,-5.67; P54 -9.912,-6.77
SIP6 = smd 0.3 x 0.52: P1 -0.508,-0.381; P2 -0.008,-0.381; P3 0.492,-0.381; P4 0.492,0.369; P5 -0.008,0.369; P6 -0.508,0.369
SOT23-5 = smd 0.55 x 1.2: 1 -0.95,-1.3; 2 0,-1.3; 3 0.95,-1.3; 4 0.95,1.3; 5 -0.95,1.3

### Placement (x,y rotation side)
$1_25_$_2020-03-30_22-52-05  40.64,48.26 0 top
BT1  29.08,43.31 270 top
C1  27.62,5.7 0 top
C2  25.4,34.92 0 top
C3  35.98,18.01 180 top
C4  35.58,6.89 180 top
C5  19.79,34.77 0 top
C6  26.21,13.38 90 top
C7  22.38,10.8 270 top
C8  21.08,13.84 0 top
C9  23.62,41.02 0 top
C10  26.16,38.1 90 top
D1  35.98,15.54 0 top
D2  36.11,9.31 0 top
D3  12.45,41.96 270 top
D4  24.13,2.54 0 top
D5  28.45,2.54 0 top
D6  35.94,2.54 0 top
D7  32.13,2.54 0 top
D8  27.99,38.1 270 top
FB1  17.53,15.62 0 top
FD1  5.08,5.08 0 top
FD2  5.08,5.08 0 bottom
FD3  36.83,46.99 0 top
FD4  36.83,46.99 0 bottom
FRAME1  1.78,-16.26 0 top  (outside the outline)
H1  STAND-OFFTIGHT  [STAND-OFF-TIGHT]  2.54,2.51 0 top
H2  2.54,48.26 0 top
H4  STAND-OFFTIGHT  [STAND-OFF-TIGHT]  40.64,2.51 0 top
J1  16.81,11.96 90 top
J2  12.7,44.48 180 top
J3  5.08,41.91 270 top
J4  38.1,41.91 90 top
J5  41.91,36.83 270 top
J6  1.27,16.51 90 top
J7  34.29,49.53 180 top
JP1  24.64,1.6 0 bottom
JP2  28.45,1.6 0 bottom
JP3  36.07,1.6 0 bottom
JP4  32.13,1.6 0 bottom
JP5  9.47,27.13 90 bottom
JP6  9.65,32 90 bottom
LOGO1  9.02,2.92 0 top
LOGO2  36.07,41.91 270 top
LOGO3  21.59,36.83 0 bottom
R1  35.98,13.23 180 top
R2  35.98,5.42 180 top
R3  19.71,36.73 180 top
R4  30.48,13.68 90 top
R5  35.98,19.54 180 top
R6  35.98,11.73 180 top
R7  24.79,7.78 270 top
R8  8.76,24.26 270 top
R9  8.76,28.7 270 top
R10  35.43,29.46 270 top
R11  35.43,22.23 270 top
R12  9.37,18.41 180 top
R13  21.34,15.62 0 top
R14  6.35,47.75 270 top
R15  19.05,47.75 270 top
R16  9.62,34 0 top
R17  24.13,1.14 0 top
R18  28.45,1.14 0 top
R19  35.94,1.14 0 top
R20  32.13,1.14 0 top
R21  13.97,38.1 270 top
R22  12.45,38.1 270 top
R23  9.75,32.03 0 top
R24  30.12,37.85 270 top
U1  29.81,9.39 180 top
U2  22.86,25.4 0 top
U3  24.33,11.05 0 top
U4  27.94,13.08 90 top
U5  23.62,38.23 180 top
U$1  [3V3-04]  36.98,31.75 0 top
U$2  [GND-04]  36.7,36.8 0 top
U$3  [D#0]  38,16.51 0 top
U$4  [PPS8]  26.67,3.81 0 top
U$5  [PWR10]  22.23,3.81 0 top
U$6  [D#1]  38.15,19.05 0 top
U$7  [#RESET2]  7.49,24.13 0 bottom
U$8  [RTK9]  34.29,3.81 0 top
U$9  [W#2]  37.72,11.46 0 top
U$10  [W#3]  37.77,13.97 0 top
U$11  [5V]  37.95,34.29 0 top
U$12  [INT1]  1.57,19.05 0 top
U$13  [PPS4]  1.68,16.46 0 top
U$14  [RXI22]  26.62,44.27 90 top
U$15  [GND-04]  34.29,44.32 90 top
U$16  [TXO21]  24.1,43.43 90 top
U$17  [SCLK1]  36.35,21.59 0 top
U$18  [TXR0]  1.57,26.57 0 top
U$19  [DEAD#RECKONING#GPS#BOARD#SILK#FINAL#JPG]  22.86,22.86 0 bottom
U$20  [DEAD#RECKONING#GPS#BOARD#SILK#FINAL#JPG]  17.02,4.7 0 top
U$21  [BLK2]  34.8,49.53 0 top
U$22  [RTK9]  37.72,3.43 0 bottom
U$23  [GRN1]  17.4,49.66 0 top
U$24  [INT2]  5.84,19.05 0 bottom
U$25  [GPS_DEAD_RECKONING0]  32,33.27 0 bottom
U$26  [CS#-<]-04]  38.1,29.21 0 top
U$27  [PPS1]  6.1,16.51 0 bottom
U$28  [#SAFEBOOT3]  10.03,21.59 0 bottom
U$29  [3V3-04]  41.66,31.75 0 bottom
U$30  [RXI#MOSI0]  41.66,26.67 0 bottom
U$31  [GND-04]  41.53,36.8 0 bottom
U$32  [X1]  6.22,12.06 0 top
U$33  [5V]  41.66,34.29 0 bottom
U$34  [GND-04]  34.29,44.32 90 bottom
U$35  [RXI28]  26.67,44.32 90 bottom
U$36  [TXO21]  24.13,43.43 90 bottom
U$37  [TXO#MISO1]  41.66,24.13 0 bottom
U$38  [SCL#CLK2]  41.66,21.59 0 bottom
U$39  [SCL5]  6.07,29.18 0 bottom
U$40  [3V3-04]  6.27,34.26 0 bottom
U$41  [GND-04]  6.48,36.8 0 bottom
U$42  [SDA4]  6.3,31.7 0 bottom
U$43  [TXR3]  6.43,26.57 0 bottom
U$44  [#RESET1]  1.52,24.13 0 top
U$45  [SPI4]  11.43,25.02 90 bottom
U$46  [I_SUPER2_C-()-04]  11.63,30.14 90 bottom
U$47  [PPS8]  30.1,3.43 0 bottom
U$48  [PWR10]  26.42,3.43 0 bottom
U$49  [ANT0]  14.86,8.64 0 top
U$50  [Y2]  10.16,15.49 0 top
U$51  [ZED#F9R0]  30.99,30.35 0 bottom
U$52  [Y2]  12.95,15.49 0 bottom
U$53  [GRN1]  21.08,49.66 0 bottom
U$54  [BLK2]  38.1,49.53 0 bottom
U$55  [#SFBT0]  1.4,21.59 0 top
U$56  [GEO1]  30.35,3.81 0 top
U$57  [Z0]  11.18,13.46 0 bottom
U$58  [GEO1]  34.04,3.43 0 bottom
U$59  [CS#-[>-04]  41.78,29.21 0 bottom
U$60  [D#0]  41.53,16.51 0 bottom
U$61  [W#2]  41.68,11.43 0 bottom
U$62  [SFE_LOGO_FLAME_.2]  20.32,43.18 0 top
U$63  [Z0]  8.38,13.46 0 top
U$64  [D#1]  41.53,19.05 0 bottom
U$65  [W#3]  41.68,13.97 0 bottom
U$66  [MISO-(]-04]  36.32,24.1 0 top
U$67  [SCL-[)]  1.65,29.18 0 top
U$68  [SDA-[)]  1.65,31.75 0 top
U$69  [MOSI-(]-04]  36.25,26.7 0 top
U$70  [3V3-04]  1.65,34.29 0 top
U$71  [GND-04]  1.65,36.8 0 top

### Tracks (layer width: path | path; a pad name or v marks a point on that pad's centre or on a via)
3.3V  (via drill 0.35, 0.38)
  Top 0.254: D4.A 22.25,2.54 21.69,1.98 v20.7,1.98 9.32,1.98 8.13,3.17 v8.13,5.84 | U1.P8 27.13,5.79 C1.1 24.84,5.7 | C7.1 22.41,11.42 U3.P6 23.82,12.57 v23.88,12.62 | R4.2 29.59,14.53 v29.26,14.86 | v25.27,12.57 25.99,12.57 C6.1 26.44,12.57 U4.P6 | 24.84,5.7 v23.57,5.7 23.55,5.7 23.55,5.37 21.39,3.2 v20.7,3.2 | R7.2 24.79,5.76 24.84,5.7
  Top 0.381: U2.P33 24.57,32.75 24.57,33.91 | U2.P34 23.45,33.73 23.62,33.91 24.57,33.91 | J4.2 v39.37,41.4 | v6.48,42.42 J3.2 | J5.3 41.02,31.75 39.75,33.02 39.75,35.18 v37.78,37.15 | D8.A 26.46,36.95 C10.1 25.84,36.93 U5.5 v24.57,35.87 24.57,34.94 C2.1 24.55,33.92 24.57,33.91 | U2.P38 19.05,34.66 C5.1 19.05,34.89 v19.05,35.81 19.05,36.65 R3.2
  Bottom 0.254: 8.13,32 6.1,32 5.21,32.89 5.21,34.29 | 8.13,32 JP6.2 | v29.26,14.86 28.57,14.86 26.29,12.57 v25.27,12.57 25.22,12.62 v23.88,12.62 23.57,12.32 v23.57,5.7 | v8.13,5.84 8.13,32 | v20.7,3.2 v20.7,1.98
  Bottom 0.381: v39.37,41.4 39.37,38.73 v37.78,37.15 36.5,35.87 v24.57,35.87 24.51,35.81 v19.05,35.81 7.05,35.81 | v6.48,42.42 6.6,42.42 7.05,41.97 7.05,35.81 | J6.8 5.21,34.29 6.22,34.29 7.05,35.12 7.05,35.81
!RESET
  Top 0.254: R8.P2 1.8,24.66 J6.4
!SAFEBOOT
  Top 0.254: R8.P3 3.54,23.86 J6.3
D_SEL  (via drill 0.3)
  Top 0.254: U2.P47 11.85,26.33 v11.81,26.29
  Bottom 0.254: v11.81,26.29 11.18,25.65 10.29,25.65 9.6,26.34 9.6,26.59 JP5.1
DIR+
  Top 0.254: R1.1 37.87,13.23 38.35,13.72 38.35,16 38.86,16.51 J5.9
DIR_IN
  Top 0.254: U1.P4 32.73,11.65 33.75,12.67 33.75,16.35 34.16,16.76 34.16,19.18 34.52,19.54 R5.2
DIR_OUT  (via drill 0.38)
  Top 0.254: U4.P4 27.57,15 28.32,15.75 v32.51,15.75 | R10.P6 36.13,29.08 37.08,29.08 37.47,28.7 v37.47,25.53
  Bottom 0.254: v32.51,15.75 33.02,15.75 34.8,17.53 36.58,17.53 37.47,18.41 v37.47,25.53
DIR_SCHMITT
  Top 0.254: U1.P6 28.95,9.9 30.48,11.43 R4.1 30.23,13.07 U4.P2
DMINUS
  Top 0.254: R21.2 13.97,36.49 14.77,35.69 17.02,35.69 17.95,34.76 U2.P39
DPLUS
  Top 0.254: U2.P40 16.89,32.77 16.89,34.16 16,35.05 13.84,35.05 12.45,36.45 R22.2
GEOF_STAT  (via drill 0.38)
  Top 0.254: D7.A 31.25,3.19 32.51,4.45 37.72,4.45 39.12,5.84 v39.12,9.65 | R11.P7 36.68,22.62 v38.99,20.32
  Bottom 0.254: v39.12,9.65 39.12,20.19 v38.99,20.32
GND  (via drill 0.3)
  Top 0.254: D3.2 12.45,43.05 v12.57,43.18 | C4.2 34.99,8.15 D2.1 | C3.2 35.05,17.66 v35.05,15.54
  Top 0.381: U5.2 23.62,40.17 C9.2
  other vias: 14.48,31.5 16.71,31.2 18.79,31.2 20.9,31.2 23.01,31.2 25.12,31.2 27.2,31.2 29.31,31.18 31.49,31.23 14.5,29.42 16.71,29.42 18.79,29.42 20.9,29.42 23.01,29.42 25.12,29.42 27.2,29.42 29.31,29.4 31.49,29.45 14.5,27.24 16.71,27.24 18.79,27.24 20.9,27.24 23.01,27.24 25.12,27.24 27.2,27.24 29.31,27.21 31.49,27.26 14.48,25.15 16.71,25.16 18.79,25.16 20.9,25.16 25.12,25.16 27.2,25.16 29.31,25.13 31.49,25.18 14.5,23.02 16.71,23.02 18.79,23.02 20.9,23.02 23.01,23.02 25.12,23.02 27.2,23.02 29.31,23 31.49,23.05 14.48,20.99 16.69,20.99 18.77,20.99 20.88,20.99 22.99,20.99 25.09,20.99 27.18,20.99 29.28,20.97 31.47,21.02 14.48,19.05 16.58,19.18 18.79,19.06 20.9,19.06 23.01,19.06 25.12,19.06 27.2,19.06 29.31,19.04 30.23,19.05 13.97,11.43 12.7,3.81 12.7,6.35 12.7,16.51 6.35,16.51 6.35,6.35 6.35,3.81 6.35,1.27 10.16,1.27 3.81,16.51 3.81,6.35 1.27,6.35 5.08,30.48 4.32,33.4 5.08,38.1 10.16,39.37 10.16,41.91 7.62,43.18 8.89,40.64 40.64,27.94 33.02,34.29 30.48,34.29 27.94,34.29 14.48,33.36 14.48,32.47 15.52,31.5 30.99,17.31 30.99,18.2 30.99,19.05 20.32,43.18 22.86,43.18 25.4,43.18 25.4,45.72 22.86,45.72 20.32,45.72 17.78,43.18 22.86,48.26 19.05,49.53 20.32,48.26 27.94,45.72 30.48,45.72 30.48,43.18 33.02,43.18 33.02,45.72 35.56,45.72 35.56,48.26 36.83,49.53 38.1,45.72 41.91,43.18 41.91,40.64 15.24,13.97 15.24,15.24 19.68,11.43 19.68,12.57 19.68,10.16 18.41,9.78 15.24,9.78 13.97,10.16 13.97,12.57 20.32,39.37 17.78,39.37 15.24,39.37 14.48,18.07 14.48,17.16 15.59,19.05 10.16,3.81 13.97,34.29 1.27,43.18 1.27,40.64 6.35,49.53 33.02,40.01 29.08,40.01 26.16,40.01 3.81,43.18 6.35,45.72 5.21,35.18 38.1,39.37 35.56,41.91 10.16,6.35 10.16,16.51 29.34,5.71 11.43,34.92 35.56,34.29 13.97,13.97 15.24,16.38 18.16,14.22 17.6,19.05 16.76,11.56 22.83,25.16 37.34,32.89 4.32,32.13 4.19,35.18 26.16,15.24 25.53,11.13 29.21,7.62 28.96,11.18 29.24,13.89 31.75,14.86 31.72,12.7 15.24,6.35 15.24,3.81 17.78,6.35 17.78,3.81 20.32,6.35 20.32,3.81 20.32,8.89 17.78,8.89 15.24,8.89 12.7,8.89 10.16,8.89 10.16,11.43 12.7,11.43 12.7,13.97 10.16,13.97 6.35,13.97 6.35,11.43 6.35,8.89 3.81,11.43 3.81,13.97 1.27,13.97 1.27,11.43 1.27,8.89 3.81,8.89 25.4,4.45 27.94,4.45 30.48,4.45 31.75,5.71 33.78,5.71 30.86,9.4 23.88,13.97 22.23,8.89 19.3,13.84 23.88,15.88 21.59,34.82 35.13,9.3 36.98,9.27 36.91,15.57 22.23,6.35 23.44,4.45 12.7,1.27 15.24,1.27 17.78,1.27 20.32,1.27 35.56,26.54 35.56,24.64 33.02,33.02 38.18,17.6 38.18,19.51 6.35,19.05 6.35,21.59 8.89,21.59 8.89,20.32 11.43,20.32 5.08,27.94 2.54,27.94 7.37,26.67
  pour Top (isolate 0.203, rank 2): 0,50.8 43.18,50.8 43.18,0 0,0
  pour Bottom (isolate 0.203, rank 2): 0,50.8 43.18,50.8 43.18,0 0,0
INT
  Top 0.254: R8.P4 5.28,23.06 J6.2
N$1  (via drill 0.3)
  Top 0.254: R23.2 11.2,32.03 v11.56,32.38
  Bottom 0.254: v11.56,32.38 11.56,31.88 10.67,30.99 9.68,30.99 JP6.1
N$2
  Top 0.254: D8.C 27.99,38.87 29.86,37 R24.2
N$3  (via drill 0.3)
  Top 0.254: R16.2 11.46,34 v11.56,33.91
  Bottom 0.254: JP6.3 10.69,33.05 v11.56,33.91
N$4
  Top 0.254: D4.C 25.01,1.44 R17.2
N$5
  Top 0.508: FB1.P2 R13.1 20.49,13.86 C8.1
N$6
  Top 0.254: J2.A6 12.95,45.72 12.7,45.97 12.19,45.97 11.95,45.73 J2.B6 11.94,44.8 11.94,42.4 D3.3
N$7
  Top 0.254: 13.45,43.81 J2.B7 | J2.A7 12.45,44.06 12.7,43.81 13.45,43.81 | D3.1 12.95,42.66 13.45,43.17 13.45,43.81
N$8  (via drill 0.38)
  Top 0.254: R17.1 22.35,1.14 v22.23,1.27
  Bottom 0.254: v22.23,1.27 22.55,1.6 JP1.2
N$9
  Top 0.254: D3.6 12.95,41.16 13.97,40.13 R21.1
N$10
  Top 0.254: D3.4 11.95,40.11 12.45,39.61 R22.1
N$11
  Top 0.254: U2.P49 11.18,24.13 10.65,24.66 R8.P7
N$12
  Top 0.254: U2.P51 11.6,21.93 10.47,23.06 R8.P5
N$14
  Top 0.254: J2.B5 10.95,46.45 10.23,47.17 R14.2
N$15
  Top 0.254: J2.A5 13.95,46.46 14.53,47.05 18.92,47.05 R15.2
N$16
  Top 0.254: U2.P44 11.43,29.63 10.1,28.3 R9.P6
N$17
  Top 0.254: U2.P45 12.9,28.57 11.05,28.57 9.98,27.5 R9.P5
N$18
  Top 0.254: R8.P8 9.84,25.46 11.81,27.43 U2.P46
N$19
  Top 0.254: U2.P42 12.08,31.83 10.15,29.9 R9.P8
N$20
  Top 0.254: U2.P43 11.79,30.73 10.16,29.1 R9.P7
N$21
  Top 0.254: U2.P27 34.21,31.83 34.81,31.23 R10.P1
N$22  (via drill 0.38)
  Top 0.254: R19.1 v34.04,1.14
  Bottom 0.254: v34.04,1.14 34.49,1.6 JP3.2
N$23  (via drill 0.38)
  Top 0.254: R18.1 27.74,1.27 v26.16,1.27
  Bottom 0.254: v26.16,1.27 26.49,1.6 JP2.2
N$24
  Top 0.254: D5.C 29.32,1.44 R18.2
N$25
  Top 0.254: D6.C 36.82,1.44 R19.2
N$26
  Top 0.254: U2.P26 33.91,30.73 34.16,30.48 34.16,29.97 34.27,29.86 R10.P2
N$27
  Top 0.254: U2.P19 33.74,23.03 34.14,22.62 R11.P2
N$28
  Top 0.254: R11.P1 34.81,23.93 34.62,24.13 U2.P20
N$29
  Top 0.254: U2.P53 11.86,19.73 10.54,18.41 R12.1
N$30
  Top 0.254: U2.P50 11.39,23.03 10.54,23.88 9.46,23.88 R8.P6
N$31
  Top 0.254: U2.P22 33.95,26.33 34.81,27.19 R10.P4
N$32
  Top 0.254: R10.P3 34.4,29.06 34.16,28.83 34.16,27.69 33.91,27.43 U2.P23
N$33  (via drill 0.3)
  Top 0.254: R20.1 30.61,1.14 v30.48,1.27
  Bottom 0.254: v30.48,1.27 30.81,1.6 JP4.2
N$34
  Top 0.254: R20.2 33.01,1.44 D7.C
N$35
  Top 0.254: R2.2 35.23,5.42 36.16,6.34 C4.1 36.11,6.94 D2.3 36.11,11.01 R6.1
N$37
  Top 0.254: R1.2 35.98,14.08 D1.3 36.56,17.22 C3.1 36.56,19.27 R5.1
PPS  (via drill 0.3, 0.38)
  Top 0.254: J6.1 3.17,18.41 R12.2 8.74,18.19 v8.74,16.56 | D5.A 26.8,2.54 25.91,3.43 22.35,3.43 21.46,2.54 9.65,2.54 8.74,3.45 v8.74,5.05
  Bottom 0.254: v8.74,16.56 v8.74,5.05
RF_IN
  Top 1: 16.82,14.81 J1.FEED
  pour Top (no thermals): 16.38,18.36 16.38,14.61 17.27,14.61 17.27,18.36
RTK_STAT  (via drill 0.38)
  Top 0.254: D6.A 35.06,3.31 35.56,3.81 37.85,3.81 39.75,5.71 v39.75,10.54 | R11.P8 36.77,23.43 v38.99,21.21
  Bottom 0.254: v39.75,10.54 39.75,20.45 v38.99,21.21
RXI2
  Top 0.254: J7.4 26.67,48.64 28.07,47.24 33.15,47.24 34.54,45.85 34.54,33.78 37.08,31.24 37.08,30.21 36.74,29.86 R10.P7
RXI/MOSI  (via drill 0.38)
  Top 0.254: v36.07,37.59 39.12,34.54 39.12,26.92 39.37,26.67 J5.5 | v9.91,37.08 9.65,36.83 9.27,36.83 7.11,34.67 7.11,29.59 7.6,29.1 R9.P2
  Bottom 0.254: v36.07,37.59 10.41,37.59 v9.91,37.08
SCL/CLK  (via drill 0.3, 0.38)
  Top 0.254: v36.7,43.43 38.08,43.43 J4.4 38.12,43.43 v39.24,43.43 | J5.7 40.26,21.59 38.1,23.75 38.1,34.04 37.34,34.8 v37.21,34.8 | J6.6 2.54,29.21 3.43,30.1 3.43,39.88 3.96,40.41 J3.4 6.07,40.41 8.13,38.35 v8.13,37.59 8.13,37.47 5.97,35.31 v5.97,33.66 | v5.97,33.66 5.97,29.21 7.68,27.5 R9.P4 | v5.97,33.66 | R16.1 8.77,34.68 9.14,35.05 v9.27,35.05
  Bottom 0.254: v8.13,37.59 8.38,37.59 9.4,38.61 34.54,38.61 36.2,40.26 36.2,42.93 v36.7,43.43 | v39.24,43.43 39.5,43.43 40.13,42.8 40.13,38.48 37.21,35.56 v37.21,34.8 | v9.27,35.05 7.87,33.66 v5.97,33.66
SDA/!CS  (via drill 0.3, 0.38)
  Top 0.254: v36.83,42.29 36.95,42.41 J4.3 38.15,42.46 39.47,42.46 40.13,41.79 40.13,41.02 39.37,40.26 39.37,37.72 v40.26,36.83 | J6.7 2.67,31.75 2.92,32 2.92,40.26 4.07,41.41 J3.3 6.34,41.41 9.27,38.48 v9.27,37.59 6.6,34.92 v6.6,32.64 6.48,32.51 6.48,29.46 7.64,28.3 R9.P3 | R23.1 8.9,32.88 8.76,33.02 v8.26,33.02
  Bottom 0.254: v9.27,37.59 9.78,38.1 35.18,38.1 36.83,39.75 v36.83,42.29 | v40.26,36.83 40.26,30.86 J5.4 | v8.26,33.02 7.87,32.64 v6.6,32.64
SHIELD  (via drill 0.38)
  other vias: 9.27,46.48 10.16,48.26 15.24,48.26 14.73,46.35
  pour Top (no thermals): 8.13,50.8 17.27,50.8 17.27,44.83 8.13,44.83
  pour Bottom (no thermals): 17.27,50.8 8.13,50.8 8.13,44.83 17.27,44.83
TX_READY
  Top 0.254: J6.5 2.54,25.4 8.09,25.4 R8.P1
TXO2
  Top 0.254: J7.5 26.92,46.74 32.89,46.74 34.04,45.59 34.04,33.53 36.11,31.45 R10.P8
TXO/MISO  (via drill 0.38)
  Top 0.254: v35.43,36.96 36.07,36.96 38.61,34.42 38.61,25.78 40.26,24.13 J5.6 | v10.79,36.7 9.78,35.69 8.89,35.69 7.62,34.42 7.62,31.24 8.14,30.72 R9.P1
  Bottom 0.254: v35.43,36.96 11.05,36.96 v10.79,36.7
V_BATT  (via drill 0.38)
  Top 0.254: U2.P36 21.25,33.54 22.1,34.39 22.1,35.43 21.59,35.94 v21.59,39.37 | R24.1 30.67,39.24 v31.39,39.24 31.39,41.01 BT1.+
  Bottom 0.254: v31.39,39.24 31.27,39.12 21.84,39.12 v21.59,39.37
V_RF
  Top 0.508: U2.P7 22.35,15.78 R13.2
VIN  (via drill 0.38)
  Top 0.254: J2.VBUS1 15.15,43.98 v14.92,43.75 | J2.VBUS2 10.25,43.65 v10.16,43.56 | D3.5 12.45,40.64 v12.83,40.26
  Top 0.381: U5.1 24.57,38.67 24,38.1 23.24,38.1 22.67,38.67 U5.3 22.67,40.79 | 22.67,40.79 22.67,40.92 C9.1 | 22.67,40.79 22.61,40.85 v21.59,40.85 14.99,40.85 v14.92,40.92 v14.92,43.75 | J5.2 41.66,34.29 v35.18,40.77
  Bottom 0.254: v14.92,43.75 14.61,44.07 10.67,44.07 v10.16,43.56 | v12.83,40.26 14.22,40.26 14.88,40.92 v14.92,40.92
  Bottom 0.381: v35.18,40.77 35.05,40.89 21.63,40.89 v21.59,40.85
WT+
  Top 0.254: R2.1 37.8,5.42 38.48,6.1 38.48,10.54 39.37,11.43 J5.11
WT_IN
  Top 0.254: U1.P1 33.65,7.36 34.34,8.05 34.34,10.94 R6.2
WT_OUT  (via drill 0.38)
  Top 0.254: v31.88,16.38 31.62,16.13 25.78,16.13 24.69,15.04 24.69,12.24 24.82,12.11 U3.P4 | v36.83,24.64 36.87,24.68 36.87,28.03 36.58,28.32 36.17,28.32 R10.P5
  Bottom 0.254: v31.88,16.38 33.02,16.38 34.67,18.03 36.32,18.03 36.83,18.54 v36.83,24.64
WT_SCHMITT
  Top 0.254: U3.P2 24.32,9.84 24.7,9.46 24.7,8.72 R7.1 U1.P7

### Text on the board
Bottom: v10
tPlace: - | +
Measures: Units In Inches
tDocu: Elias Santistevan